# Altium project Smart_Plugs.PrjPcb
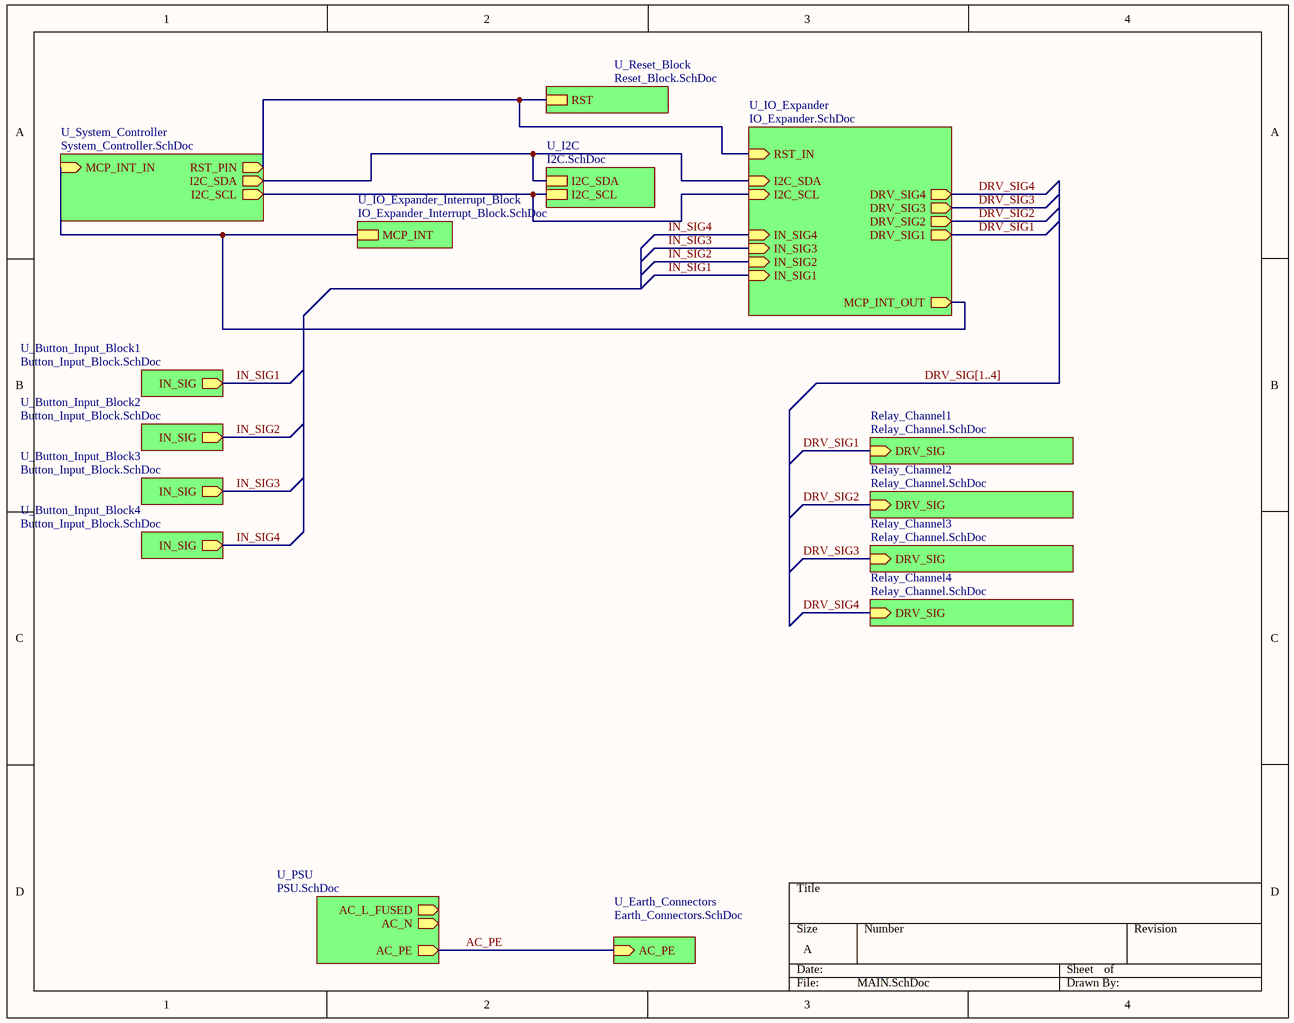
[diagram p0: MAIN.SchDoc]
10 sheets, 70 parts. Net scope: hierarchical (ports join the sheet entries above them; power ports are global).
Board file: Smart_Plug_PCB.PcbDoc
Sheets:
  MAIN.SchDoc
    U_PSU = PSU.SchDoc
    Relay_Channel1 = Relay_Channel.SchDoc
    U_IO_Expander = IO_Expander.SchDoc
    U_I2C = I2C.SchDoc
    U_Reset_Block = Reset_Block.SchDoc
    U_Earth_Connectors = Earth_Connectors.SchDoc
    U_IO_Expander_Interrupt_Block = IO_Expander_Interrupt_Block.SchDoc
    U_System_Controller = System_Controller.SchDoc
    Relay_Channel2 = Relay_Channel.SchDoc
    Relay_Channel3 = Relay_Channel.SchDoc
    Relay_Channel4 = Relay_Channel.SchDoc
    U_Button_Input_Block1 = Button_Input_Block.SchDoc
    U_Button_Input_Block2 = Button_Input_Block.SchDoc
    U_Button_Input_Block3 = Button_Input_Block.SchDoc
    U_Button_Input_Block4 = Button_Input_Block.SchDoc

## Sheet MAIN.SchDoc
size A; SheetNumber: 1; SheetTotal: 10

### Sub-sheets
Relay_Channel1 = Relay_Channel.SchDoc: DRV_SIG (in)
Relay_Channel2 = Relay_Channel.SchDoc: DRV_SIG (in)
Relay_Channel3 = Relay_Channel.SchDoc: DRV_SIG (in)
Relay_Channel4 = Relay_Channel.SchDoc: DRV_SIG (in)
U_Button_Input_Block1 = Button_Input_Block.SchDoc: IN_SIG (out)
U_Button_Input_Block2 = Button_Input_Block.SchDoc: IN_SIG (out)
U_Button_Input_Block3 = Button_Input_Block.SchDoc: IN_SIG (out)
U_Button_Input_Block4 = Button_Input_Block.SchDoc: IN_SIG (out)
U_Earth_Connectors = Earth_Connectors.SchDoc: AC_PE (in)
U_I2C = I2C.SchDoc: I2C_SCL, I2C_SDA
U_IO_Expander = IO_Expander.SchDoc: I2C_SDA (in), I2C_SCL (in), RST_IN (in), IN_SIG4 (in), IN_SIG3 (in), IN_SIG1 (in), IN_SIG2 (in), DRV_SIG4 (out), DRV_SIG1 (out), DRV_SIG3 (out), DRV_SIG2 (out), MCP_INT_OUT (out)
U_IO_Expander_Interrupt_Block = IO_Expander_Interrupt_Block.SchDoc: MCP_INT
U_PSU = PSU.SchDoc: AC_N (out), AC_L_FUSED (out), AC_PE (out)
U_Reset_Block = Reset_Block.SchDoc: RST
U_System_Controller = System_Controller.SchDoc: RST_PIN (out), MCP_INT_IN (in), I2C_SDA (out), I2C_SCL (out)

### Nets
AC_PE: sheet U_PSU/AC_PE, sheet U_Earth_Connectors/AC_PE
DRV_SIG1: sheet Relay_Channel1/DRV_SIG, sheet U_IO_Expander/DRV_SIG1
DRV_SIG2: sheet U_IO_Expander/DRV_SIG2, sheet Relay_Channel2/DRV_SIG
DRV_SIG3: sheet U_IO_Expander/DRV_SIG3, sheet Relay_Channel3/DRV_SIG
DRV_SIG4: sheet U_IO_Expander/DRV_SIG4, sheet Relay_Channel4/DRV_SIG
IN_SIG1: sheet U_IO_Expander/IN_SIG1, sheet U_Button_Input_Block1/IN_SIG
IN_SIG2: sheet U_IO_Expander/IN_SIG2, sheet U_Button_Input_Block2/IN_SIG
IN_SIG3: sheet U_IO_Expander/IN_SIG3, sheet U_Button_Input_Block3/IN_SIG
IN_SIG4: sheet U_IO_Expander/IN_SIG4, sheet U_Button_Input_Block4/IN_SIG
NetH1_11: sheet U_IO_Expander/RST_IN, sheet U_Reset_Block/RST, sheet U_System_Controller/RST_PIN
NetH2_10: sheet U_IO_Expander/MCP_INT_OUT, sheet U_IO_Expander_Interrupt_Block/MCP_INT, sheet U_System_Controller/MCP_INT_IN
NetH2_14: sheet U_IO_Expander/I2C_SCL, sheet U_I2C/I2C_SCL, sheet U_System_Controller/I2C_SCL
NetH2_17: sheet U_IO_Expander/I2C_SDA, sheet U_I2C/I2C_SDA, sheet U_System_Controller/I2C_SDA

### Buses and harness runs
bus DRV_SIG[1..4]

## Sheet PSU.SchDoc
size A; SheetNumber: 2; SheetTotal: 10
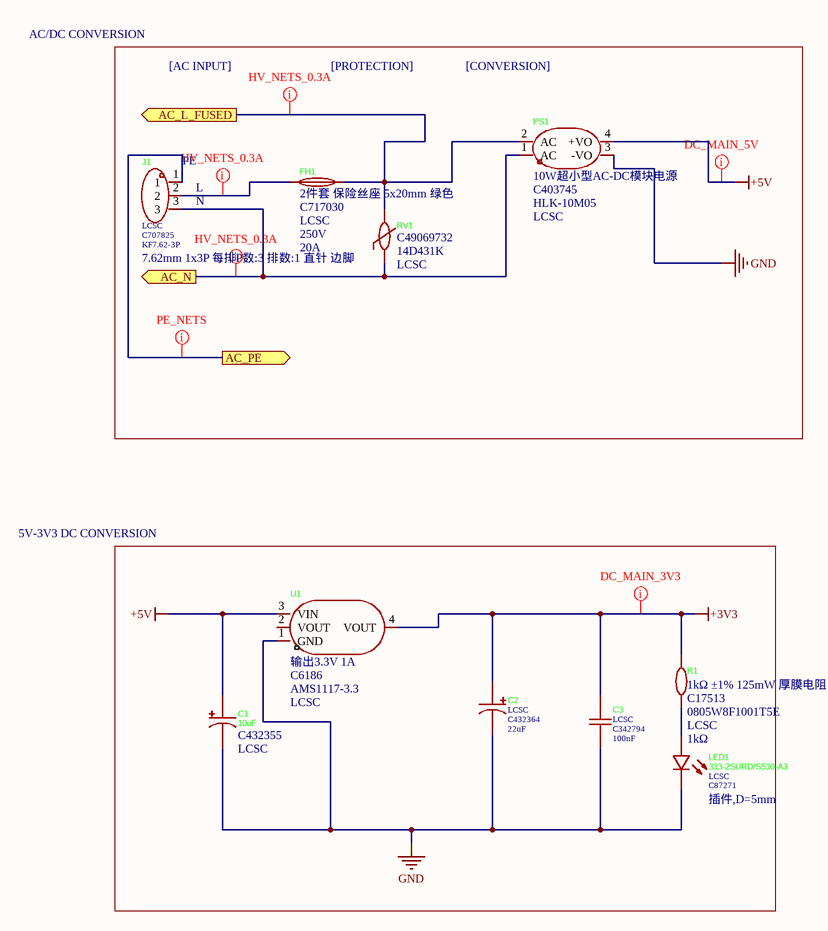
[diagram p1: PSU.SchDoc]

### Parts
C1  10uF  Supplier Part: C432355  Supplier: LCSC  [CAP-TH_BD5.0-P2.00-D0.8-FD]
C2  Supplier: LCSC  Supplier Part: C432364  [CAP-TH_BD5.0-P2.00-D0.5-FD-1]  (hidden comment: 22uF)
C3  Supplier: LCSC  Supplier Part: C342794  [CAP-TH_L4.0-W2.5-P5.00-D1.0]  (hidden comment: 100nF)
FH1  LCSC Part Name: 2件套 保险丝座 5x20mm 绿色  Supplier Part: C717030  Supplier: LCSC  Voltage Rating: 250V  Current Rating: 20A  [FUSE-TH_L24.4-W9.4-P22.60]  (hidden comment: PTF-77)
J1  Supplier: LCSC  Supplier Part: C707825  LCSC Part Name: 7.62mm 1x3P 每排P数:3 排数:1 直针 边脚  [CONN-TH_KF7.62-3P]  (hidden comment: KF7.62-3P)
LED1  333-2SURD/S530-A3  Supplier: LCSC  Supplier Part: C87271  Supplier Footprint: 插件,D=5mm  [LED-TH_BD5.9-P2.54-RD_RED]
PS1  LCSC Part Name: 10W超小型AC-DC模块电源  Supplier Part: C403745  Supplier: LCSC  [PWRM-TH_HLK-10M05]  (hidden comment: HLK-10M05)
R1  LCSC Part Name: 1kΩ ±1% 125mW 厚膜电阻  Supplier Part: C17513  Supplier: LCSC  [R0805]  (hidden comment: 1kΩ)
RV1  Supplier Part: C49069732  Manufacturer Part: 14D431K  Supplier: LCSC  [RES-TH_L14.5-W6.0-P7.50-D0.8-S6.0]  (hidden comment: 440pF)
U1  LCSC Part Name: 输出3.3V 1A  Supplier Part: C6186  Supplier: LCSC  [SOT-223-3_L6.5-W3.4-P2.30-LS7.0-BR]  (hidden comment: AMS1117-3.3)

### Ports
AC_L_FUSED (out), AC_N (out), AC_PE (out)

### Nets
+3V3: C2.1 C3.1 R1.2 U1.4(VOUT)
+5V: C1.1 PS1.4(+VO) U1.3(VIN)
GND: C1.2 C2.2 C3.2 LED1.1(C) PS1.3(-VO) U1.1(GND)
AC_PE: J1.1 ; port AC_PE
NetFH1_1: FH1.1 J1.2
NetFH1_2: FH1.2 PS1.2(AC) RV1.2 ; port AC_L_FUSED
NetJ1_3: J1.3 PS1.1(AC) RV1.1 ; port AC_N
NetLED1_2: LED1.2(A) R1.1

Not connected (* = marked no-connect by the designer): U1 2(VOUT)

### Layout directives
net class HV_NETS_0.3A: NetFH1_1, NetFH1_2, NetJ1_3
net class PE_NETS: AC_PE
net class DC_MAIN_5V: +5V
net class DC_MAIN_3V3: +3V3

### Notes on the sheet
- AC/DC CONVERSION
- [AC INPUT]
- [PROTECTION]
- [CONVERSION]
- (near J1) PE
- (near J1) L
- (near J1) N
- 5V-3V3 DC CONVERSION

### Library data of the parts
C1 = 50YXJ10M5X11: Manufacturer: Rubycon(红宝石); Add into BOM: yes; Tolerance: ±20%; Voltage Rating: 50V; Pin Spacing: 2mm; Lifetime: 5000hrs@105℃; Symbol: 50YXJ10M5X11; Device: 50YXJ10M5X11; Value: 10uF; LCSC Part Name: 10uF ±20% 50V; Manufacturer Part: 50YXJ10M5X11; Supplier Footprint: 插件,D5xL11mm; JLCPCB Part Class: Extended Part; Datasheet: https://item.szlcsc.com/datasheet/50YXJ10M5X11/429163.html; Convert to PCB: yes; Diameter: 5mm; Height - Seated (Max): 11mm
C2 = 50YXJ22M5X11: Manufacturer: rubycon(红宝石); Add into BOM: yes; Tolerance: ±20%; Symbol: 50YXJ22M5X11; Device: 50YXJ22M5X11; Manufacturer Part: 50YXJ22M5X11; LCSC Part Name: 22uF ±20% 50V; Supplier Footprint: 插件,D5xL11mm; JLCPCB Part Class: Extended Part; Datasheet: https://atta.szlcsc.com/upload/public/pdf/source/20190927/C432444_D90212164DBC1B856ABE912664018FD4.pdf; Convert to PCB: yes; Ripple Current: -; Equivalent Series Resistance(ESR): -; Lead Spacing: 2mm; Lifetime @ Temp: -; Value: 22uF
C3 = FG28X7R1H104KNT06: Manufacturer: TDK; Add into BOM: yes; Tolerance: ±10%; Voltage Rating: 50V; Temperature Coefficient: X7R; Pin Spacing: 5mm; Symbol: FG28X7R1H104KNT06; Device: FG28X7R1H104KNT06; LCSC Part Name: 100nF ±10% 50V; Manufacturer Part: FG28X7R1H104KNT06; Supplier Footprint: 插件,P=5mm; JLCPCB Part Class: Extended Part; Datasheet: https://item.szlcsc.com/datasheet/FG28X7R1H104KNT06/319644.html; Convert to PCB: yes; Value: 100nF
FH1 = PTF-77: Manufacturer: XFCN(兴飞); Add into BOM: yes; Fuseholder Type: Bracket type; Number of Circuits: 1; Fuse Type: Cylindrical; Fuse Diameter (φD): 5mm; Fuse Length: 20mm; Symbol: PTF-77; Device: PTF-77; Manufacturer Part: PTF-77; Supplier Footprint: 插件,P=22.5mm; JLCPCB Part Class: Extended Part; Datasheet: https://item.szlcsc.com/datasheet/PTF-77/757629.html; Convert to PCB: yes
J1 = KF7.62-3P: Manufacturer: KEFA(科发); Barrier Type: 2-Side; Pitch: 7.62mm; Add into BOM: yes; Number of Positions or Pins: 1x3P; Pin Location: Side Mount; Number of PINs Per Row: 3; Current Rating: 24A; Voltage Rating (Max): 450V; Wire Gauge - AWG: 12~22; Wire Gauge - mm2: 2.5; Symbol: KF7.62-3P; Device: KF7.62-3P; JLCPCB Part Class: Extended Part; Supplier Footprint: 插件,P=7.62mm; Datasheet: https://item.szlcsc.com/datasheet/KF7.62-3P/745034.html; Convert to PCB: yes; Mounting Type: Straight Pin; Number of Pins: 3P; Number of Rows: 1; Operating Temperature: -40℃~+105℃; Color: Black; Manufacturer Part: KF7.62-3P
LED1 = 333-2SURD/S530-A3: Manufacturer: EVERLIGHT(亿光); Lamp Holder Type: 5 mm round LED; Add into BOM: yes; Illumination Color: Red; Voltage - Forward(Vf): 2V; Forward Current: 20mA; Wavelength - Dominant: 624nm; Peak Wavelength: 632nm; Lens Color: Red Lens; Luminous Intensity: 200mcd; Viewing Angle: 30°; Symbol: 333-2SURD/S530-A3; Device: 333-2SURD/S530-A3; Manufacturer Part: 333-2SURD/S530-A3; LCSC Part Name: 5mm圆形灯头 红色; JLCPCB Part Class: Extended Part; Datasheet: https://en.everlight.com/wp-content/plugins/ItemRelationship/product_files/pdf/333-2SURD-S530-A3.pdf; Convert to PCB: yes
PS1 = HLK-10M05: Manufacturer: HI-LINK(海凌科); Add into BOM: yes; Symbol: HLK-10M05; Device: HLK-10M05; Supplier Footprint: DIP,46.9x27.8mm; JLCPCB Part Class: Extended Part; Datasheet: https://item.szlcsc.com/datasheet/HLK-10M05/389994.html; Convert to PCB: yes; Manufacturer Part: HLK-10M05
R1 = 0805W8F1001T5E: Manufacturer: UNI-ROYAL(厚声); Add into BOM: yes; Tolerance: ±1%; Temperature Coefficient: ±100ppm/℃; Symbol: 0805W8F1001T5E; Device: 0805W8F1001T5E; Supplier Footprint: 0805; JLCPCB Part Class: Basic Part; Datasheet: https://atta.szlcsc.com/upload/public/pdf/source/20200306/C422600_1E6D84923E4A46A82E41ADD87F860B5C.pdf; Convert to PCB: yes; Type: Thick Film Resistors; Operating Temperature Range: -55℃~+155℃; Manufacturer Part: 0805W8F1001T5E; Value: 1kΩ
RV1 = 14D431K_C49069732: Manufacturer: R+O(宏嘉诚); Add into BOM: yes; Varistor Voltage: 387V~473V; Clamping Voltage: 710V; Maximum DC Volts: 350V; Maximum AC Volts: 275V; Peak Current: 4.5kA; Energy: 136J; Rated Wattage: 600mW; Symbol: 14D431K_C49069732; Device: 14D431K_C49069732; LCSC Part Name: 710V 136J; Supplier Footprint: 插件,P=7.5mm; JLCPCB Part Class: Extended Part; Datasheet: https://item.szlcsc.com/datasheet/14D431K/51445298.html; Convert to PCB: yes; Value: 440pF
U1 = AMS1117-3.3_C6186: Manufacturer: AMS; Add into BOM: yes; Output Type: Fixed; Voltage - Supply: 16V; Output Voltage: 3.3V; Output Current: 1A; Power Supply Rejection Ratio (PSRR): 72dB@(120Hz); Voltage Dropout: 1.1V@(800mA); standby current: 5mA; Noise: 0.003%Vout; Output Configuration: Positive; Number of Outputs: 1; Symbol: AMS1117-3.3; Device: AMS1117-3.3_C6186; Supplier Footprint: SOT-223; JLCPCB Part Class: Basic Part; Datasheet: https://item.szlcsc.com/datasheet/AMS1117-3.3/6652.html; Convert to PCB: yes; Features: Over Current Protection；Over Temperature Protection; Operating Temperature: -40℃~+125℃; Manufacturer Part: AMS1117-3.3

## Sheet Relay_Channel.SchDoc
size A; SheetNumber: 6; SheetTotal: 10
Used 4 times, as channels Relay_Channel1, Relay_Channel2, Relay_Channel3, Relay_Channel4. Parts and nets are listed once, with the designators drawn on the sheet.
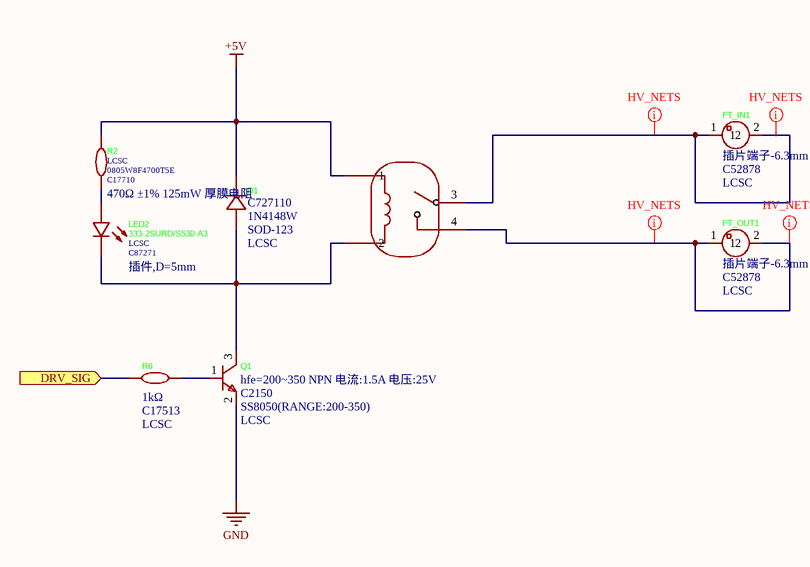
[diagram p2: Relay_Channel.SchDoc]

### Parts
D1  Supplier Part: C727110  Supplier Footprint: SOD-123  Supplier: LCSC  [SOD-123_L3.1-W1.7-LS3.7-RD]  (hidden comment: 1N4148W)
FT_IN1  LCSC Part Name: 插片端子-6.3mm  Supplier Part: C52878  Supplier: LCSC  [CONN-TH_L6.3-W0.8-EST026]  (hidden comment: EST026)
FT_OUT1  LCSC Part Name: 插片端子-6.3mm  Supplier Part: C52878  Supplier: LCSC  [CONN-TH_L6.3-W0.8-EST026]  (hidden comment: EST026)
K1  HF105F-1/005D-1HST  [HF105F-1_005D-1HST1_Update]  (value not drawn)
LED2  333-2SURD/S530-A3  Supplier: LCSC  Supplier Part: C87271  Supplier Footprint: 插件,D=5mm  [LED-TH_BD5.9-P2.54-RD_RED]
Q1  LCSC Part Name: hfe=200~350 NPN 电流:1.5A 电压:25V  Supplier Part: C2150  Supplier: LCSC  [SOT-23-3_L2.9-W1.3-P1.90-LS2.4-BR]  (hidden comment: SS8050(RANGE:200-350))
R2  Supplier: LCSC  Supplier Part: C17710  LCSC Part Name: 470Ω ±1% 125mW 厚膜电阻  [R0805]  (hidden comment: 470Ω)
R6  Supplier Part: C17513  Supplier: LCSC  [R0805]  (hidden comment: 1kΩ)

### Ports
DRV_SIG (in)

### Nets
+5V: D1.1(K) K1.1 R2.2
GND: Q1.2(E)
DRV_SIG: R6.1 ; port DRV_SIG
NetD1_2: D1.2(A) K1.2 LED2.1(C) Q1.3(C)
NetFT_IN1_1: FT_IN1.1 FT_IN1.2 K1.3
NetFT_OUT1_1: FT_OUT1.1 FT_OUT1.2 K1.4
NetLED2_2: LED2.2(A) R2.1
NetQ1_1: Q1.1(B) R6.2

### Channels
Relay_Channel1: designators end in 1; ports DRV_SIG=DRV_SIG1
Relay_Channel2: designators end in 2; ports DRV_SIG=DRV_SIG2
Relay_Channel3: designators end in 3; ports DRV_SIG=DRV_SIG3
Relay_Channel4: designators end in 4; ports DRV_SIG=DRV_SIG4

### Layout directives
net class HV_NETS: NetFT_IN11_1, NetFT_OUT11_1

### Library data of the parts
D1 = 1N4148W_C727110: Manufacturer: TWGMC(台湾迪嘉); Current - Rectified: 300mA; Pd - Power Dissipation: 400mW; Reverse Leakage Current (Ir): 1uA; Non-Repetitive Peak Forward Surge Current: 4A; Add into BOM: yes; Diode Configuration: Independent; Voltage - DC Reverse(Vr): 100V; Reverse Recovery Time (trr): 8ns; Operating Junction Temperature Range: -55℃~+150℃@(Tj); Symbol: 1N4148W_C727110; Device: 1N4148W_C727110; LCSC Part Name: 1N4148W; JLCPCB Part Class: Extended Part; Datasheet: https://item.szlcsc.com/datasheet/1N4148W/774215.html; Convert to PCB: yes; Voltage - Forward(Vf@If): -; Manufacturer Part: 1N4148W
FT_IN1 FT_OUT1 = EST026: Manufacturer: xcfuse(旭程); Add into BOM: yes; Symbol: EST026; Device: EST026; Manufacturer Part: EST026; Supplier Footprint: 插件; JLCPCB Part Class: Extended Part; Datasheet: https://item.szlcsc.com/datasheet/EST026/53893.html; Convert to PCB: yes
K1 = HF105F-1/005D-1HST: Manufacturer: HF(宏发); Add into BOM: yes; Coil Voltage: 5V; Contact Form: 1 Set Normally Open: 1A (SPST NO); Contact Rating: 30A@240VAC；20A@28VDC; Switching Voltage(Max): 277V@AC；28V@DC; Coil Rated Power: 900mW; Switching Current(Max): 40A; Coil Type: Non-Polarized - Single Coil; Coil Resistance: 27Ω; Contact Resistance: 50mΩ; Operate Time: 15ms; Release Time: 10ms; Symbol: HF105F-1/005D-1HST; Device: HF105F-1/005D-1HST; LCSC Part Name: 小型大功率5V继电器 单刀单掷-常开; Supplier Part: C2976768; Manufacturer Part: HF105F-1/005D-1HST; Supplier Footprint: 插件,32.3x27.1mm; JLCPCB Part Class: Extended Part; Datasheet: https://item.szlcsc.com/datasheet/HF105F-1%252F005D-1HST/3384988.html; Supplier: LCSC; Convert to PCB: yes; Number of Pins: 4; Contact Material: AgSnO2; Operating Temperature: -55℃~+85℃
LED2 = 333-2SURD/S530-A3: as LED1 on sheet PSU; Symbol: 333-2SURD/S530-A3; Device: 333-2SURD/S530-A3; Manufacturer Part: 333-2SURD/S530-A3; LCSC Part Name: 5mm圆形灯头 红色; JLCPCB Part Class: Extended Part; Datasheet: https://en.everlight.com/wp-content/plugins/ItemRelationship/product_files/pdf/333-2SURD-S530-A3.pdf; Convert to PCB: yes
Q1 = SS8050(RANGE:200-350)_C2150: Manufacturer: CJ(江苏长电/长晶); Symbol: SS8050_C2150; Add into BOM: yes; type: NPN; Current - Collector(Ic): 1.5A; Collector - Emitter Voltage VCEO: 25V; Pd - Power Dissipation: 300mW; DC Current Gain: 200@800mA,1V; Transition frequency(fT): 100MHz; Current - Collector Cutoff: 100nA; Vce Saturation(VCE(sat)): 500mV@800mA,80mA; Emitter-Base Voltage(Vebo): 5V; Number: 1 NPN; Device: SS8050(RANGE:200-350)_C2150; Supplier Footprint: SOT-23; JLCPCB Part Class: Basic Part; Datasheet: https://item.szlcsc.com/datasheet/SS8050(RANGE%253A200-350)/2507.html; Convert to PCB: yes; Operating Temperature: -55℃~+150℃; Manufacturer Part: SS8050(RANGE:200-350)
R2 = 0805W8F4700T5E: Manufacturer: UNI-ROYAL(厚声); Add into BOM: yes; Tolerance: ±1%; Power(Watts): 125mW; Voltage-Supply(Max): 150V; Temperature Coefficient: ±100ppm/℃; Symbol: 0805W8F4700T5E; Device: 0805W8F4700T5E; Supplier Footprint: 0805; JLCPCB Part Class: Basic Part; Datasheet: https://item.szlcsc.com/datasheet/0805W8F4700T5E/18398.html; Convert to PCB: yes; Type: Thick Film Resistor; Value: 470Ω; Operating Temperature: -55℃~+155℃; Manufacturer Part: 0805W8F4700T5E
R6 = 0805W8F1001T5E: as R1 on sheet PSU; Symbol: 0805W8F1001T5E; Device: 0805W8F1001T5E; Supplier Footprint: 0805; JLCPCB Part Class: Basic Part; Datasheet: https://atta.szlcsc.com/upload/public/pdf/source/20200306/C422600_1E6D84923E4A46A82E41ADD87F860B5C.pdf; Convert to PCB: yes; Type: Thick Film Resistors; Operating Temperature Range: -55℃~+155℃; LCSC Part Name: 1kΩ ±1% 125mW 厚膜电阻; Manufacturer Part: 0805W8F1001T5E; Value: 1kΩ

## Sheet IO_Expander.SchDoc
size A; SheetNumber: 5; SheetTotal: 10
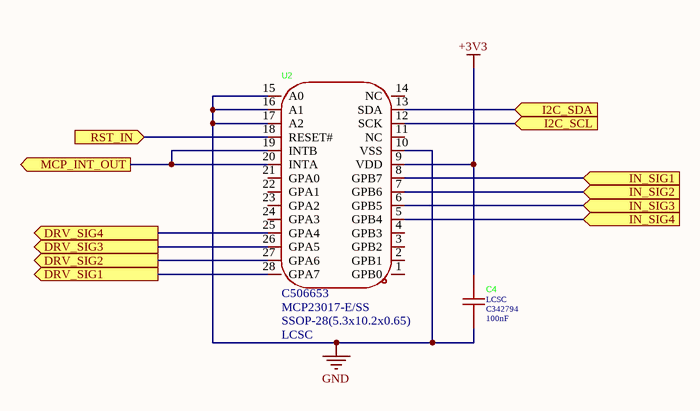
[diagram p3: IO_Expander.SchDoc]

### Parts
C4  Supplier: LCSC  Supplier Part: C342794  [CAP-TH_L4.0-W2.5-P5.00-D1.0]  (hidden comment: 100nF)
U2  Supplier Part: C506653  Supplier Footprint: SSOP-28(5.3x10.2x0.65)  Supplier: LCSC  [SSOP-28_L10.2-W5.3-P0.65-LS7.8-BL]  (hidden comment: MCP23017-E/SS)

### Ports
DRV_SIG1 (out), DRV_SIG2 (out), DRV_SIG3 (out), DRV_SIG4 (out), I2C_SCL (in), I2C_SDA (in), IN_SIG1 (in), IN_SIG2 (in), IN_SIG3 (in), IN_SIG4 (in), MCP_INT_OUT (out), RST_IN (in)

### Nets
+3V3: C4.2 U2.9(VDD)
GND: C4.1 U2.10(VSS) U2.15(A0) U2.16(A1) U2.17(A2)
DRV_SIG1: U2.28(GPA7) ; port DRV_SIG1
DRV_SIG2: U2.27(GPA6) ; port DRV_SIG2
DRV_SIG3: U2.26(GPA5) ; port DRV_SIG3
DRV_SIG4: U2.25(GPA4) ; port DRV_SIG4
IN_SIG1: U2.8(GPB7) ; port IN_SIG1
IN_SIG2: U2.7(GPB6) ; port IN_SIG2
IN_SIG3: U2.6(GPB5) ; port IN_SIG3
IN_SIG4: U2.5(GPB4) ; port IN_SIG4
NetH1_11: U2.18(RESET#) ; port RST_IN
NetH2_10: U2.19(INTB) U2.20(INTA) ; port MCP_INT_OUT
NetH2_14: U2.12(SCK) ; port I2C_SCL
NetH2_17: U2.13(SDA) ; port I2C_SDA

Not connected (* = marked no-connect by the designer): U2 1(GPB0) 2(GPB1) 3(GPB2) 4(GPB3) 11(NC) 14(NC) 21(GPA0) 22(GPA1) 23(GPA2) 24(GPA3)

### Library data of the parts
C4 = FG28X7R1H104KNT06: as C3 on sheet PSU; Symbol: FG28X7R1H104KNT06; Device: FG28X7R1H104KNT06; LCSC Part Name: 100nF ±10% 50V; Manufacturer Part: FG28X7R1H104KNT06; Supplier Footprint: 插件,P=5mm; JLCPCB Part Class: Extended Part; Datasheet: https://item.szlcsc.com/datasheet/FG28X7R1H104KNT06/319644.html; Convert to PCB: yes; Value: 100nF
U2 = MCP23017-E/SS: Manufacturer: MICROCHIP(美国微芯); Add into BOM: yes; Interface: I2C; Number of I/O: 16; Voltage - Supply: 1.8V~5.5V; Current - Output Low(IOL): 8mA; Clock Frequency: 1.7MHz; Number of Supporting Devices: 8; Quiescent Current: 1uA; Output Logic Level - Low: 600mV; Symbol: MCP23017-E/SS; Device: MCP23017-E/SS; LCSC Part Name: 16位带串行接口的I/O扩展器; JLCPCB Part Class: Extended Part; Datasheet: https://item.szlcsc.com/datasheet/MCP23017-E%252FSS/519857.html; Convert to PCB: yes; Interrupt Output: Interrupt Output; Output Type: -; Current - Output High(IOH): -; Operating Temperature: -40℃~+125℃; Manufacturer Part: MCP23017-E/SS

## Sheet I2C.SchDoc
size A; SheetNumber: 7; SheetTotal: 10
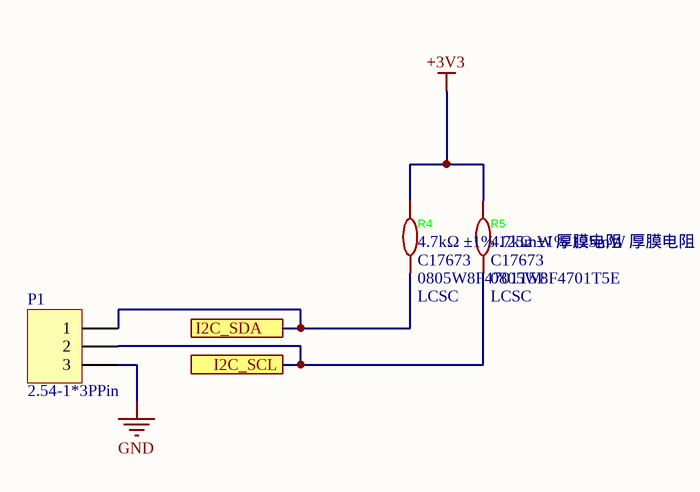
[diagram p4: I2C.SchDoc]

### Parts
P1  2.54-1*3PPin  [HDR1X3]
R4  LCSC Part Name: 4.7kΩ ±1% 125mW 厚膜电阻  Supplier Part: C17673  Supplier: LCSC  [R0805]  (hidden comment: 4.7kΩ)
R5  LCSC Part Name: 4.7kΩ ±1% 125mW 厚膜电阻  Supplier Part: C17673  Supplier: LCSC  [R0805]  (hidden comment: 4.7kΩ)

### Ports
I2C_SCL, I2C_SDA

### Nets
+3V3: R4.2 R5.2
GND: P1.3
NetH2_14: P1.2 R5.1 ; port I2C_SCL
NetH2_17: P1.1 R4.1 ; port I2C_SDA

### Library data of the parts
P1 = Header 3: -40℃~+105℃ 1 1x3P 2.54mm 2.5mm 3A 3P 3mm 6mm Black Brass Gold Pin Header Through Hole Plugin,P=2.54mm Pin Headers ROHS; LatestRevisionDate: 17-Jul-2002; LatestRevisionNote: Re-released for DXP Platform.; Publisher: Altium Limited
R4 R5 = 0805W8F4701T5E: Manufacturer: UNI-ROYAL(厚声); Add into BOM: yes; Tolerance: ±1%; Temperature Coefficient: ±100ppm/℃; Symbol: 0805W8F4701T5E; Device: 0805W8F4701T5E; Supplier Footprint: 0805; JLCPCB Part Class: Basic Part; Datasheet: https://atta.szlcsc.com/upload/public/pdf/source/20200306/C422600_1E6D84923E4A46A82E41ADD87F860B5C.pdf; Convert to PCB: yes; Type: Thick Film Resistors; Value: 4.7kΩ; Operating Temperature Range: -55℃~+155℃; Manufacturer Part: 0805W8F4701T5E

## Sheet Reset_Block.SchDoc
size A; SheetNumber: 10; SheetTotal: 10
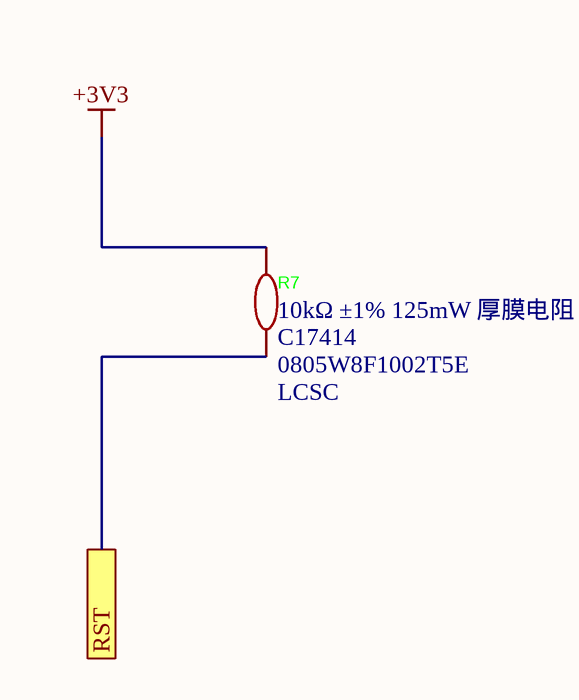
[diagram p5: Reset_Block.SchDoc]

### Parts
R7  LCSC Part Name: 10kΩ ±1% 125mW 厚膜电阻  Supplier Part: C17414  Supplier: LCSC  [R0805]  (hidden comment: 10kΩ)

### Ports
RST

### Nets
+3V3: R7.2
NetH1_11: R7.1 ; port RST

### Library data of the parts
R7 = 0805W8F1002T5E: Manufacturer: UNI-ROYAL(厚声); Add into BOM: yes; Tolerance: ±1%; Power(Watts): 125mW; Voltage-Supply(Max): 150V; Temperature Coefficient: ±100ppm/℃; Symbol: 0805W8F1002T5E; Device: 0805W8F1002T5E; Value: 10kΩ; Supplier Footprint: 0805; JLCPCB Part Class: Basic Part; Datasheet: https://item.szlcsc.com/datasheet/0805W8F1002T5E/18102.html; Convert to PCB: yes; Type: Thick Film Resistor; Operating Temperature: -55℃~+155℃; Manufacturer Part: 0805W8F1002T5E

## Sheet Earth_Connectors.SchDoc
size A; SheetNumber: 3; SheetTotal: 10
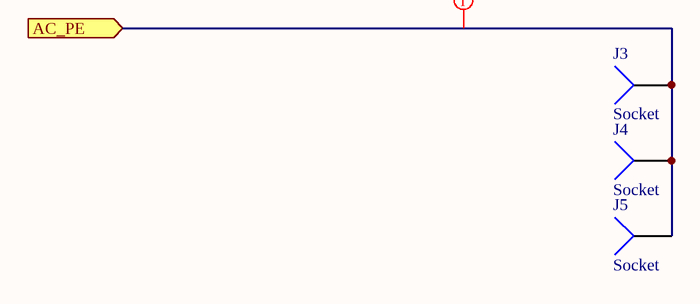
[diagram p6: Earth_Connectors.SchDoc]

### Parts
J3  Socket  [PIN1]
J4  Socket  [PIN1]
J5  Socket  [PIN1]

### Ports
AC_PE (in)

### Nets
AC_PE: J3.1 J4.1 J5.1 ; port AC_PE

### Layout directives
net class PE_NETS: AC_PE

### Library data of the parts
J3-J5 = Socket: LatestRevisionDate: 17-Jul-2002; LatestRevisionNote: Re-released for DXP Platform.; Publisher: Altium Limited

## Sheet IO_Expander_Interrupt_Block.SchDoc
size A; SheetNumber: 9; SheetTotal: 10
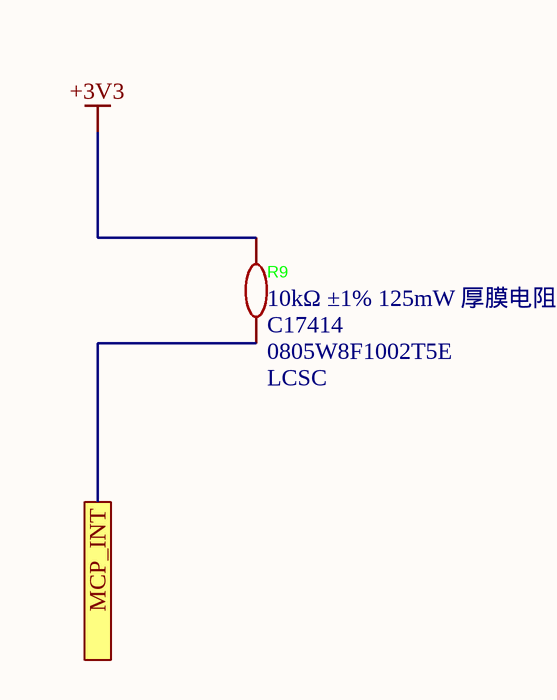
[diagram p7: IO_Expander_Interrupt_Block.SchDoc]

### Parts
R9  LCSC Part Name: 10kΩ ±1% 125mW 厚膜电阻  Supplier Part: C17414  Supplier: LCSC  [R0805]  (hidden comment: 10kΩ)

### Ports
MCP_INT

### Nets
+3V3: R9.2
NetH2_10: R9.1 ; port MCP_INT

### Library data of the parts
R9 = 0805W8F1002T5E: as R7 on sheet Reset_Block; Symbol: 0805W8F1002T5E; Device: 0805W8F1002T5E; Value: 10kΩ; Supplier Footprint: 0805; JLCPCB Part Class: Basic Part; Datasheet: https://item.szlcsc.com/datasheet/0805W8F1002T5E/18102.html; Convert to PCB: yes; Type: Thick Film Resistor; Operating Temperature: -55℃~+155℃; Manufacturer Part: 0805W8F1002T5E

## Sheet System_Controller.SchDoc
size A; SheetNumber: 4; SheetTotal: 10
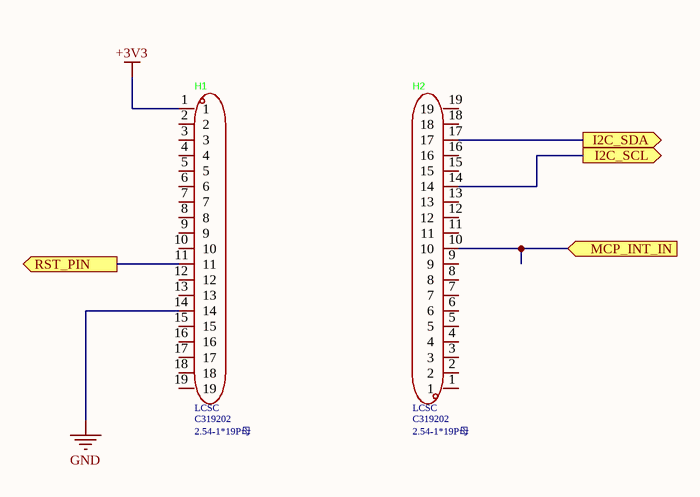
[diagram p8: System_Controller.SchDoc]

### Parts
H1  Supplier: LCSC  Supplier Part: C319202  [HDR-TH_19P-P2.54-V-F]  (hidden comment: 2.54-1*19P母)
H2  Supplier: LCSC  Supplier Part: C319202  [HDR-TH_19P-P2.54-V-F]  (hidden comment: 2.54-1*19P母)

### Ports
I2C_SCL (out), I2C_SDA (out), MCP_INT_IN (in), RST_PIN (out)

### Nets
+3V3: H1.1
GND: H1.14
NetH1_11: H1.11 ; port RST_PIN
NetH2_10: H2.10 ; port MCP_INT_IN
NetH2_14: H2.14 ; port I2C_SCL
NetH2_17: H2.17 ; port I2C_SDA

Not connected (* = marked no-connect by the designer): H1 2 3 4 5 6 7 8 9 10 12 13 15 16 17 18 19; H2 1 2 3 4 5 6 7 8 9 11 12 13 15 16 18 19

### Library data of the parts
H1 H2 = 2.54-1*19P母: Manufacturer: BOOMELE(博穆精密); Add into BOM: yes; Pitch: 2.54mm; Circular Hole / Square Hole: Square Hole; Number of Positions: 19P; Holes Direction: Top; Symbol: 2.54-1*19P母; Device: 2.54-1*19P母; LCSC Part Name: 间距:2.54mm 直插; Supplier Footprint: 插件,P=2.54mm; JLCPCB Part Class: Extended Part; Convert to PCB: yes; Row Spacing: -; Mounting Type: Through Hole; Number of Rows: 1; Insulation Height: -; Contact Material: -; Contact Plating: -; Manufacturer Part: 2.54-1*19P母

## Sheet Button_Input_Block.SchDoc
size A; SheetNumber: 8; SheetTotal: 10
Used 4 times, as channels U_Button_Input_Block1, U_Button_Input_Block2, U_Button_Input_Block3, U_Button_Input_Block4. Parts and nets are listed once, with the designators drawn on the sheet.
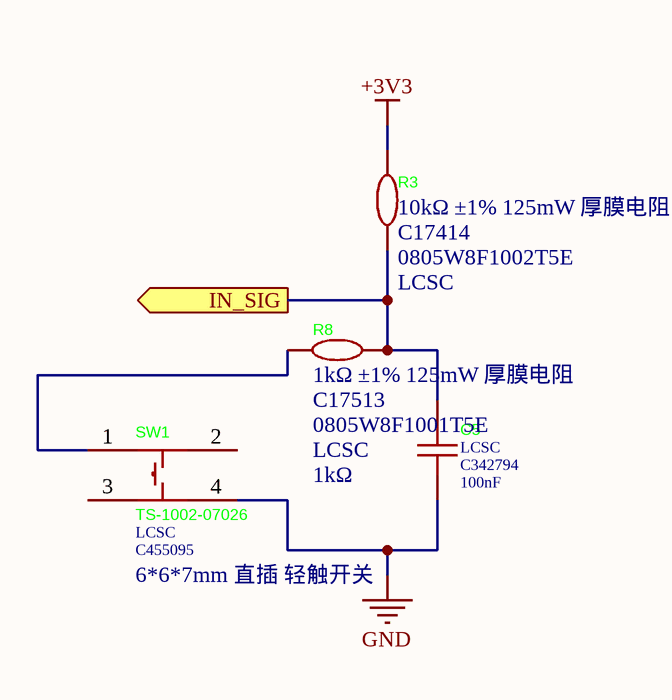
[diagram p9: Button_Input_Block.SchDoc]

### Parts
C5  Supplier: LCSC  Supplier Part: C342794  [CAP-TH_L4.0-W2.5-P5.00-D1.0]  (hidden comment: 100nF)
R3  LCSC Part Name: 10kΩ ±1% 125mW 厚膜电阻  Supplier Part: C17414  Supplier: LCSC  [R0805]  (hidden comment: 10kΩ)
R8  LCSC Part Name: 1kΩ ±1% 125mW 厚膜电阻  Supplier Part: C17513  Supplier: LCSC  [R0805]  (hidden comment: 1kΩ)
SW1  TS-1002-07026  Supplier: LCSC  Supplier Part: C455095  LCSC Part Name: 6*6*7mm 直插 轻触开关  [SW-TH_4P-L6.0-W6.0-P4.50-LS6.5]

### Ports
IN_SIG (out)

### Nets
+3V3: R3.2
GND: C5.1 SW1.4
IN_SIG: C5.2 R3.1 R8.2 ; port IN_SIG
NetR8_1: R8.1 SW1.1

Not connected (* = marked no-connect by the designer): SW1 2 3

### Channels
U_Button_Input_Block1: designators end in 1; ports IN_SIG=IN_SIG1
U_Button_Input_Block2: designators end in 2; ports IN_SIG=IN_SIG2
U_Button_Input_Block3: designators end in 3; ports IN_SIG=IN_SIG3
U_Button_Input_Block4: designators end in 4; ports IN_SIG=IN_SIG4

### Library data of the parts
C5 = FG28X7R1H104KNT06: as C3 on sheet PSU; Symbol: FG28X7R1H104KNT06; Device: FG28X7R1H104KNT06; LCSC Part Name: 100nF ±10% 50V; Manufacturer Part: FG28X7R1H104KNT06; Supplier Footprint: 插件,P=5mm; JLCPCB Part Class: Extended Part; Datasheet: https://item.szlcsc.com/datasheet/FG28X7R1H104KNT06/319644.html; Convert to PCB: yes; Value: 100nF
R3 = 0805W8F1002T5E: as R7 on sheet Reset_Block; Symbol: 0805W8F1002T5E; Device: 0805W8F1002T5E; Value: 10kΩ; Supplier Footprint: 0805; JLCPCB Part Class: Basic Part; Datasheet: https://item.szlcsc.com/datasheet/0805W8F1002T5E/18102.html; Convert to PCB: yes; Type: Thick Film Resistor; Operating Temperature: -55℃~+155℃; Manufacturer Part: 0805W8F1002T5E
R8 = 0805W8F1001T5E: as R1 on sheet PSU; Symbol: 0805W8F1001T5E; Device: 0805W8F1001T5E; Supplier Footprint: 0805; JLCPCB Part Class: Basic Part; Datasheet: https://atta.szlcsc.com/upload/public/pdf/source/20200306/C422600_1E6D84923E4A46A82E41ADD87F860B5C.pdf; Convert to PCB: yes; Type: Thick Film Resistors; Operating Temperature Range: -55℃~+155℃; Manufacturer Part: 0805W8F1001T5E; Value: 1kΩ
SW1 = TS-1002-07026: Manufacturer: XUNPU(讯普); Add into BOM: yes; Circuit: SPST; Actuator Style: Round Button; Switch Height: 7mm; Contact Current: 50mA; Voltage Rating: 12V; Symbol: TS-1002-07026; Device: TS-1002-07026; Manufacturer Part: TS-1002-07026; Supplier Footprint: 插件,6x6mm; JLCPCB Part Class: Extended Part; Datasheet: https://item.szlcsc.com/datasheet/TS-1002-07026/457500.html; Convert to PCB: yes; Mounting Type: Through Hole; Length: 6mm; Width: 6mm; With Lamp: -; Life: -

## Nets that join several sheets
+3V3: PSU (C2.1 C3.1 R1.2 U1.4), IO_Expander (C4.2 U2.9), I2C (R4.2 R5.2), Reset_Block (R7.2), IO_Expander_Interrupt_Block (R9.2), System_Controller (H1.1), U_Button_Input_Block1 (R31.2), U_Button_Input_Block2 (R32.2), U_Button_Input_Block3 (R33.2), U_Button_Input_Block4 (R34.2)
+5V: PSU (C1.1 PS1.4 U1.3), Relay_Channel1 (D11.1 K11.1 R21.2), Relay_Channel2 (D12.1 K12.1 R22.2), Relay_Channel3 (D13.1 K13.1 R23.2), Relay_Channel4 (D14.1 K14.1 R24.2)
GND: PSU (6 pins), Relay_Channel1 (Q11.2), IO_Expander (5 pins), I2C (P1.3), System_Controller (H1.14), Relay_Channel2 (Q12.2), Relay_Channel3 (Q13.2), Relay_Channel4 (Q14.2), U_Button_Input_Block1 (C51.1 SW11.4), U_Button_Input_Block2 (C52.1 SW12.4), U_Button_Input_Block3 (C53.1 SW13.4), U_Button_Input_Block4 (C54.1 SW14.4)
AC_PE: PSU (J1.1), Earth_Connectors (J3.1 J4.1 J5.1)
DRV_SIG1: Relay_Channel1 (R61.1), IO_Expander (U2.28)
DRV_SIG2: IO_Expander (U2.27), Relay_Channel2 (R62.1)
DRV_SIG3: IO_Expander (U2.26), Relay_Channel3 (R63.1)
DRV_SIG4: IO_Expander (U2.25), Relay_Channel4 (R64.1)
IN_SIG1: IO_Expander (U2.8), U_Button_Input_Block1 (C51.2 R31.1 R81.2)
IN_SIG2: IO_Expander (U2.7), U_Button_Input_Block2 (C52.2 R32.1 R82.2)
IN_SIG3: IO_Expander (U2.6), U_Button_Input_Block3 (C53.2 R33.1 R83.2)
IN_SIG4: IO_Expander (U2.5), U_Button_Input_Block4 (C54.2 R34.1 R84.2)
NetH1_11: IO_Expander (U2.18), Reset_Block (R7.1), System_Controller (H1.11)
NetH2_10: IO_Expander (U2.19 U2.20), IO_Expander_Interrupt_Block (R9.1), System_Controller (H2.10)
NetH2_14: IO_Expander (U2.12), I2C (P1.2 R5.1), System_Controller (H2.14)
NetH2_17: IO_Expander (U2.13), I2C (P1.1 R4.1), System_Controller (H2.17)